# EAGLE design attinier85-motherboard-smd-mk-1.0 (EAGLE 6.5.0)
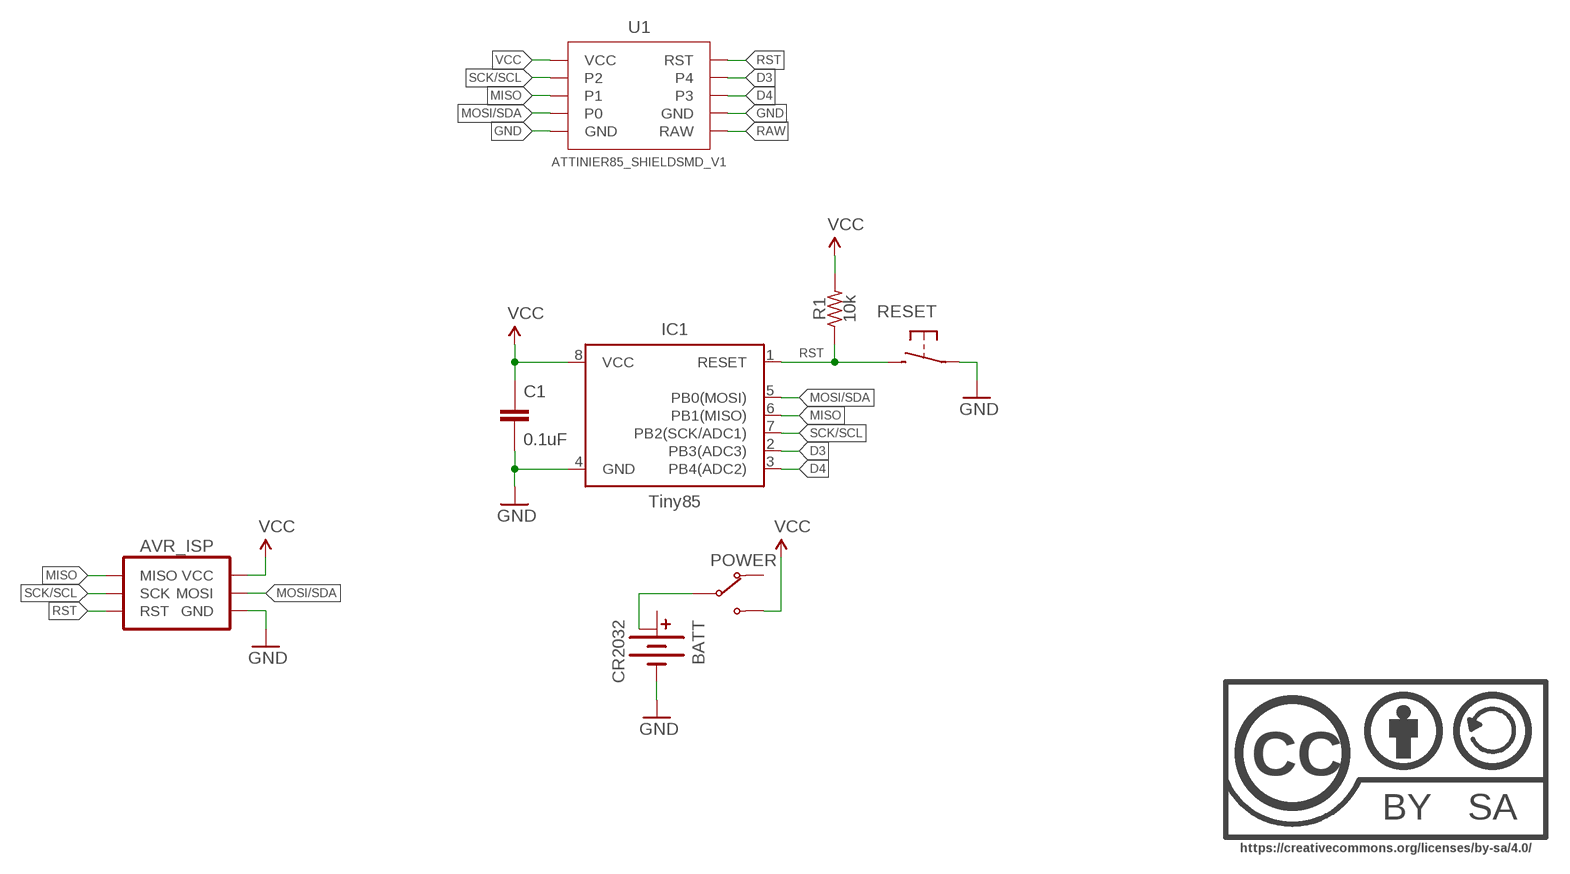
[diagram p0: schematic, sheet 1]

## Parts
AVR_ISP  AVR_SPI_PRG_62X3_SMD  [2X3_SMD]
BATT  CR2032  BATTERY-COINCR2032_SMD  [BATTCON_20MM_MINE]
C1  0.1uF  CAPACITOR-CERAMICC0805  [C0805]
IC1  Tiny85  ATTINY45TINY85-20-SOICW  [SO08-EIAJ]
POWER  SWITCH-SPDTPTH-RA-2.54MM  [SPDT-RA-2.54MM]
R1  10k  RESISTORR0805  [R0805]
RESET  DTS-6MM  SPST-NO-TACT3MM-RA  [TACTILE-PTH-SIDE]
U1  ATTINIER85_SHIELDSMD_V1  [ATTINIER85_SHIELD_SMD]
U$1  CC-BY-SA-4.0NO-URL  [CC-BY-SA-4.0-NO-URL]

## Nets
D3: IC1.2(PB3(ADC3)) U1.4
D4: IC1.3(PB4(ADC2)) U1.3
GND: AVR_ISP.6(GND) BATT.BOTTOM(-) C1.2 IC1.4(GND) RESET.1 U1.GND@1(GND) U1.GND@2(GND)
MISO: AVR_ISP.1(MISO) IC1.6(PB1(MISO)) U1.1
MOSI/SDA: AVR_ISP.4(MOSI) IC1.5(PB0(MOSI)) U1.0
N$1: BATT.TOP@2(+1) POWER.2(COM)
RAW: U1.RAW
RST: AVR_ISP.5(RST) IC1.1(RESET) R1.1 RESET.2 U1.RST
SCK/SCL: AVR_ISP.3(SCK) IC1.7(PB2(SCK/ADC1)) U1.2
VCC: AVR_ISP.2(VCC) C1.1 IC1.8(VCC) POWER.3(NO) R1.2 U1.VCC
Unconnected: BATT.TOP@1(+) POWER.1(NC)

## Library data of the parts
AVR_ISP = A_butts:AVR_SPI_PRG_6: AVR ISP 6 Pin This is the reduced ISP connector for AVR programming. Common on Arduino. This footprint will take up less PCB space and can be used with a 10-pin to 6-pin adapter such as SKU: BOB-08508 **Special note about "TEST_POINT" package. The stop mask is on the top side, so if you want your programming test points to be on the bottom of your board, make sure to place this package on the bottom side of the board. This also ensure that the orientation to program from the bottom side will be correct.
BATT = A_butts:BATTERY-COIN
C1 = A_butts:CAPACITOR-CERAMIC: CAPACITOR, European symbol
IC1 = A_butts:ATTINY45: Atmel 8-pin 2/4/8kB flash uC; PROD_ID: IC-09092; VALUE: Tiny85-20-SMT
POWER = A_butts:SWITCH-SPDT
R1 = A_butts:RESISTOR: RESISTOR, American symbol
RESET = A_butts:SPST-NO-TACT
U1 = A_butts:ATTINIER85_SHIELD
U$1 = A_butts:CC-BY-SA-4.0

## Board
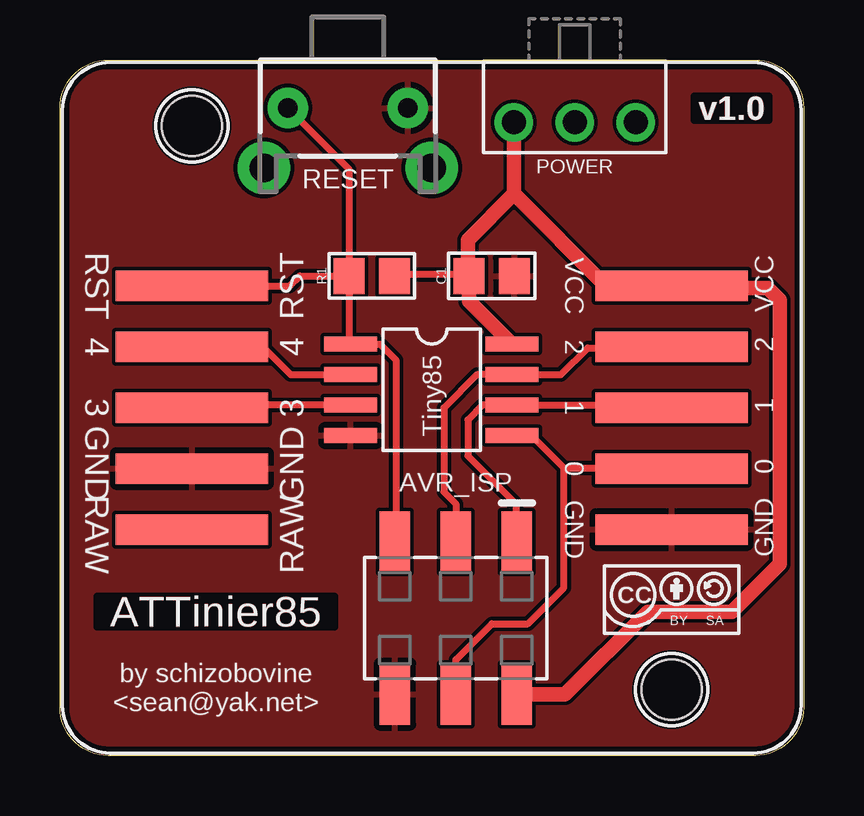
[diagram p1: board, top side]
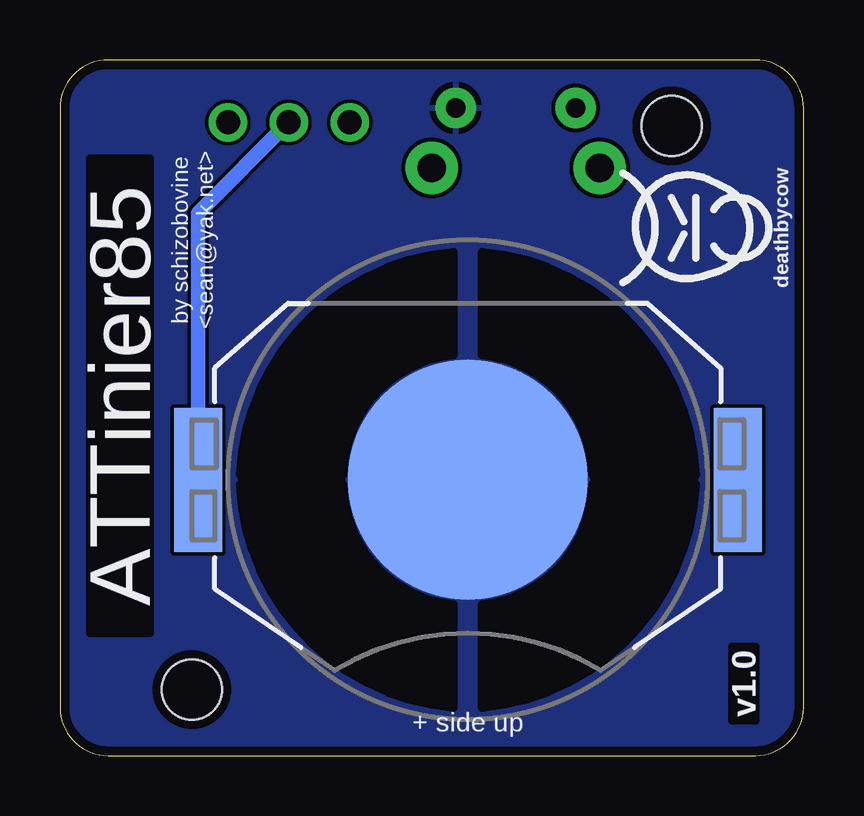
[diagram p2: board, bottom side, seen from below]

Size 31 x 29 mm. Coordinates in mm from the lower left corner, seen from the top.
Copper layers (1*16): Top 0.0356mm / dielectric 1.5011mm / Bottom 0.0356mm
Design rules "LaenPCBOrder2": minimum track width 6mil, minimum drill 13mil, track to track 6mil, track to pad 6mil, pad to pad 6mil, via to via 6mil, smd to smd 6mil, copper to edge 15mil, drill to drill 6mil, minimum pad ring 7mil, minimum via ring 7mil, stop-mask expansion 3mil, vias tented up to drill 20mil, thermal gap 10mil

### Footprints (pad centres in the part's own frame; a part is rotated, then mirrored left to right if it is on the bottom)
2X3_SMD = smd 1.27 x 2.54: 1 -2.54,-3.175; 2 -2.54,3.175; 3 0,-3.175; 4 0,3.175; 5 2.54,-3.175; 6 2.54,3.175
BATTCON_20MM_MINE = smd 10 x 10: BOTTOM 0,0 | smd 6 x 2: TOP@1 0,11.25; TOP@2 0,-11.25
C0805 = smd 1.3 x 1.5: 1 -0.95,0; 2 0.95,0
SO08-EIAJ = smd 0.61 x 2.21: 1 -1.905,-3.378; 2 -0.635,-3.378; 3 0.635,-3.378; 4 1.905,-3.378; 5 1.905,3.353; 6 0.635,3.353; 7 -0.635,3.353; 8 -1.905,3.353
SPDT-RA-2.54MM = drill 1 pad 1.6: 1 0,0; 2 2.54,0; 3 5.08,0
R0805 = smd 1.3 x 1.5: 1 -0.95,0; 2 0.95,0
TACTILE-PTH-SIDE = drill 0.8 pad 1.7: 1 -2.5,0; 2 2.5,0 | drill 1.2 pad 2.2: ANCHOR1 -3.5,2.5; ANCHOR2 3.5,2.5
ATTINIER85_SHIELD_SMD = smd 6.35 x 1.27: 0 10,-2.54; 1 10,0; 2 10,2.54; 3 -10,0; 4 -10,2.54; GND@1 -10,-2.54; GND@2 10,-5.08; RAW -10,-5.08; RST -10,5.08; VCC 10,5.08 | hole 2.5: -10,11.75; 10,-11.75

### Placement (x,y rotation side)
AVR_ISP  16.5,5.73 180 top
BATT  14,11.5 270 bottom
C1  18,20 0 top
IC1  15.5,15.25 270 top
POWER  24,26.4 180 top
R1  13,20 0 top
RESET  12,27 180 top
U1  15.5,14.5 0 top
U$1  25.5,6.5 0 top
U$3  [COW_SMALL]  5,22 90 bottom

### Tracks (layer width: path | path; a pad name or v marks a point on that pad's centre or on a via)
D3
  Top 0.3: U1.4 8.46,17.04 9.62,15.88 IC1.2
D4
  Top 0.3: IC1.3 5.62,14.62 U1.3
GND
  pour Top: 31.1,29.1 31.1,-0.1 -0.1,-0.1 -0.1,29.1
  pour Bottom: 31.1,29.1 31.1,-0.1 -0.1,-0.1 -0.1,29.1
MISO
  Top 0.3: AVR_ISP.1 19,8.95 19,10.5 17,12.5 17,14 17.61,14.62 IC1.6 25.39,14.62 U1.1
MOSI/SDA
  Top 0.3: AVR_ISP.4 16.5,4 18,5.5 19.5,5.5 21,7 21,12 | 21,12 25.46,12 U1.0 | IC1.5 19.66,13.35 21,12
N$1
  Bottom 0.6: BATT.TOP@2 25.25,22.61 POWER.2
RST
  Top 0.3: RESET.2 12.05,24.45 R1.1 | R1.1 12.05,17.23 IC1.1 13.35,17.16 14,16.5 14,8.95 AVR_ISP.5 | U1.RST 9.58,19.58 10,20 R1.1
SCK/SCL
  Top 0.3: AVR_ISP.3 16.5,10.5 16,11 16,14.5 17.39,15.88 IC1.7 20.89,15.88 22,17 25.46,17 U1.2
VCC
  Top 0.3: 17,20.05 14,20.05 R1.2
  Top 0.6: POWER.3 18.92,23.42 | 18.92,23.42 17,21.5 17,20.05 C1.1 17.05,18.96 IC1.8 | 18.92,23.42 22.76,19.58 U1.VCC 25.58,19.5 29.5,19.5 30,19 30,8 28,6 24.5,6 21.05,2.56 AVR_ISP.2

### Text on the board
Top: ATTinier85
Bottom: motherboard | ATTinier85
tPlace: ATTinier85 | by schizobovine / <sean@yak.net>
bPlace: motherboard | by schizobovine / <sean@yak.net> | ATTinier85 | + side up